# Altium schematic sheet Program_Counter.SchDoc
size Letter; SheetNumber: 7; SheetTotal: 9
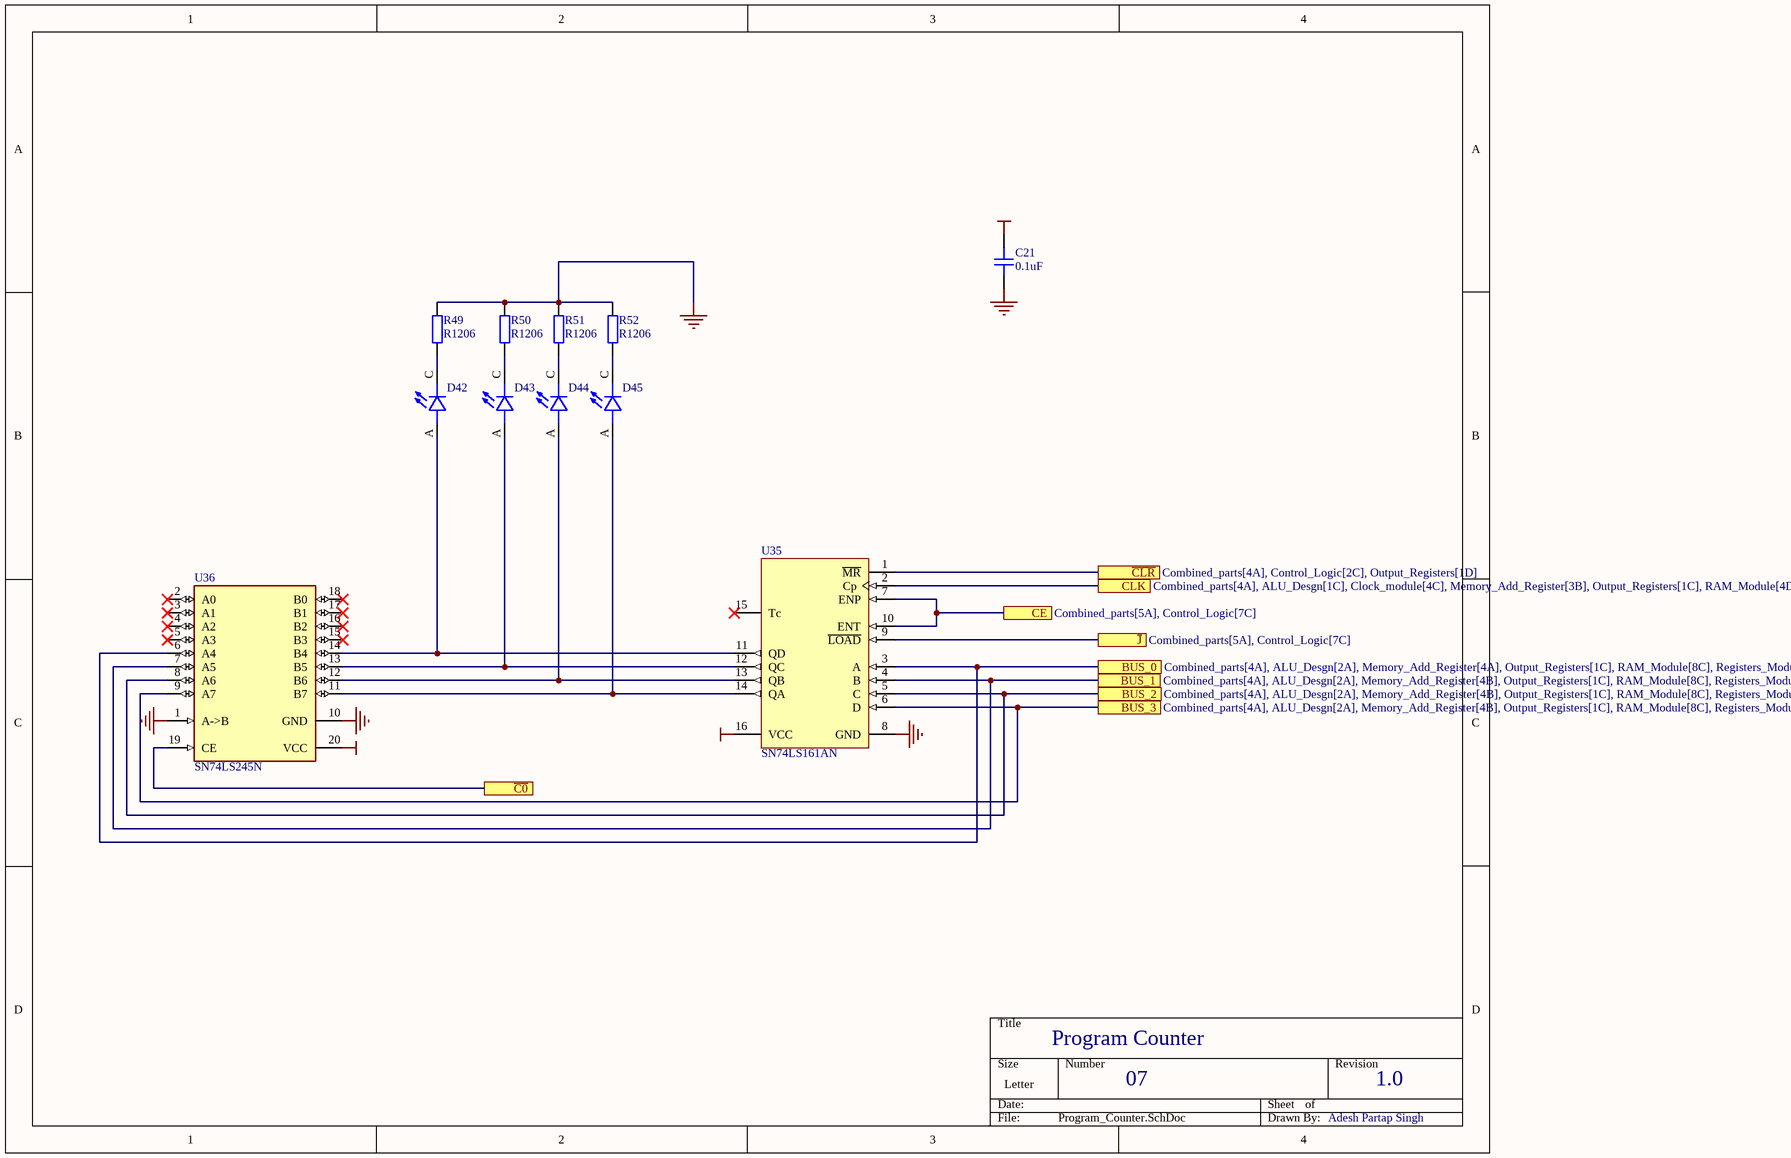
[diagram p0: Program_Counter.SchDoc]

## Parts
C21  0.1uF  [CAP_0805]
D42  L08R5000Q1  [LEDRD254W57D500H1070]  (value not drawn)
D43  L08R5000Q1  [LEDRD254W57D500H1070]  (value not drawn)
D44  L08R5000Q1  [LEDRD254W57D500H1070]  (value not drawn)
D45  L08R5000Q1  [LEDRD254W57D500H1070]  (value not drawn)
R49  R1206  [RES_1206]
R50  R1206  [RES_1206]
R51  R1206  [RES_1206]
R52  R1206  [RES_1206]
U35  SN74LS161AN  [N0016A]
U36  SN74LS245N  [FP-N0020A-MFG]

## Ports
BUS_0 (see Combined_parts[4A], ALU_Desgn[2A], Memory_Add_Register[4A], Output_Registers[1C], RAM_Module[8C], Registers_Module[2A], Registers_Module[8A], Registers_Module[8C]), BUS_1 (see Combined_parts[4A], ALU_Desgn[2A], Memory_Add_Register[4B], Output_Registers[1C], RAM_Module[8C], Registers_Module[2A], Registers_Module[8A], Registers_Module[8C]), BUS_2 (see Combined_parts[4A], ALU_Desgn[2A], Memory_Add_Register[4B], Output_Registers[1C], RAM_Module[8C], Registers_Module[2A], Registers_Module[8A], Registers_Module[8C]), BUS_3 (see Combined_parts[4A], ALU_Desgn[2A], Memory_Add_Register[4B], Output_Registers[1C], RAM_Module[8C], Registers_Module[2A], Registers_Module[8A], Registers_Module[8C]), CE (see Combined_parts[5A], Control_Logic[7C]), CLK (see Combined_parts[4A], ALU_Desgn[1C], Clock_module[4C], Memory_Add_Register[3B], Output_Registers[1C], RAM_Module[4D], Registers_Module[2A], Registers_Module[8A], Registers_Module[8C]), ~{C0}, ~{CLR} (see Combined_parts[4A], Control_Logic[2C], Output_Registers[1D]), ~{J} (see Combined_parts[5A], Control_Logic[7C])

## Nets
GND: C21.1 R49.2 R50.2 R51.2 R52.2 U35.8(GND) U36.1(A->B) U36.10(GND)
VCC: C21.2 U35.16(VCC) U36.20(VCC)
BUS_0: U35.3(A) U36.6(A4) ; port BUS_0
BUS_1: U35.4(B) U36.7(A5) ; port BUS_1
BUS_2: U35.5(C) U36.8(A6) ; port BUS_2
BUS_3: U35.6(D) U36.9(A7) ; port BUS_3
~{C0}: U36.19(CE) ; port ~{C0}
~{CLR}: U35.1(~{MR}) ; port ~{CLR}
CE: U35.7(ENP) U35.10(ENT) ; port CE
CLK: U35.2(Cp) ; port CLK
~{J}: U35.9(~{LOAD}) ; port ~{J}
NetD42_A: D42.A U35.11(QD) U36.14(B4)
NetD42_C: D42.C R49.1
NetD43_A: D43.A U35.12(QC) U36.13(B5)
NetD43_C: D43.C R50.1
NetD44_A: D44.A U35.13(QB) U36.12(B6)
NetD44_C: D44.C R51.1
NetD45_A: D45.A U35.14(QA) U36.11(B7)
NetD45_C: D45.C R52.1

Not connected (* = marked no-connect by the designer): U35 15(Tc)*; U36 2(A0)* 3(A1)* 4(A2)* 5(A3)* 15(B3)* 16(B2)* 17(B1)* 18(B0)*

## Notes on the sheet
- Program Counter
- 07
- 1.0
- Adesh Partap Singh

## Library data of the parts
C21 = CAP_0805: Capacitor SMD 0805; Manufacturer: *; Manufacturer Part Number: *; Distributor Link: *; LCSC: *; Rating: *; Dielectric: *
D42-D45 = L08R5000Q1: LED, 5MM, ORANGE; LED / Lamp Size: 5mm / T-1 3/4; LED Colour: Orange; Typ Luminous Intensity: 4.3mcd; Viewing Angle: ...; MF: LED Technology; Value: *; SnapEDA_Link: https://www.snapeda.com/parts/L08R5000Q1/LED+Technology/view-part/?ref=snap; MP: L08R5000Q1; Check_prices: https://www.snapeda.com/parts/L08R5000Q1/LED+Technology/view-part/?ref=eda; Availability: In Stock; Price: None; Package: None
R49-R52 = RES_1206: Resistor SMD 1206; Manufacturer: *; Manufacturer Part Number: *; Distributor Link: *; LCSC: *
U35 = IC_BINARY_COUNTER-4-BIT_16DIP: Synchronous 4-Bit Binary Counters, N0016A, TUBE; Manufacturer: Texas Instruments; VCC(Max)(V): 5.25; tpd @ Nom Voltage(Max)(ns): 35; Output Type: CMOS; Input Type: TTL; ICC @ Nom Voltage(Max)(mA): 32; VCC(Min)(V): 4.75; Technology Family: LS; Voltage(Nom)(V): 5; Output Drive (IOL/IOH)(Max)(mA): 8/-0.4; Inputs: 1; Schmitt Trigger: No; Rating: Catalog; Bits(#): 4; Type: Binary; Generic Part Number: SN74LS161A; Code_JEDEC: MS-001; F @ Nom Voltage(Max)(Mhz): 35; Function: Counter; PackageReference: N0016A; DatasheetVersion: SDLS060; Operating Temperature Range(C): 0 to 70
U36 = CMP-1620-00419-3: IC TXRX NON-INVERT 5.25V 20DIP; Number of Bits per Element: 8; Polarity: Non-Inverting; Low Level Output Current: 24mA; Propagation Delay: 12ns; Min Supply Voltage: 4.75V; Number of Elements: 1; Quiescent Current: 62mA; Logic Function: Transceiver; Direction: Bidirectional; Operating Supply Voltage: 5V; High Level Output Current: -15mA; Mount: Through Hole; Min Operating Temperature: 0°C; Number of Outputs: 8; Max Operating Temperature: 70°C; Max Supply Voltage: 5.25V; Width: 6.35mm; Number of Pins: 20; RoHS Compliant: Yes; Turn-On Delay Time: 12ns; Termination: Through Hole; Number of Channels: 8; Number of Circuits: 8; Weight: 0.042297oz; Package Quantity: 20; Number of Transceivers: 8; Length: 24.33mm; Height: 4.57mm; REACH SVHC: No SVHC; Contact Plating: Gold; Number of Bits: 8; Lead Free: Lead Free; Case/Package: PDIP; Packaging: Rail/Tube; Radiation Hardening: No